# EAGLE schematic M225A (EAGLE 6.6.0)
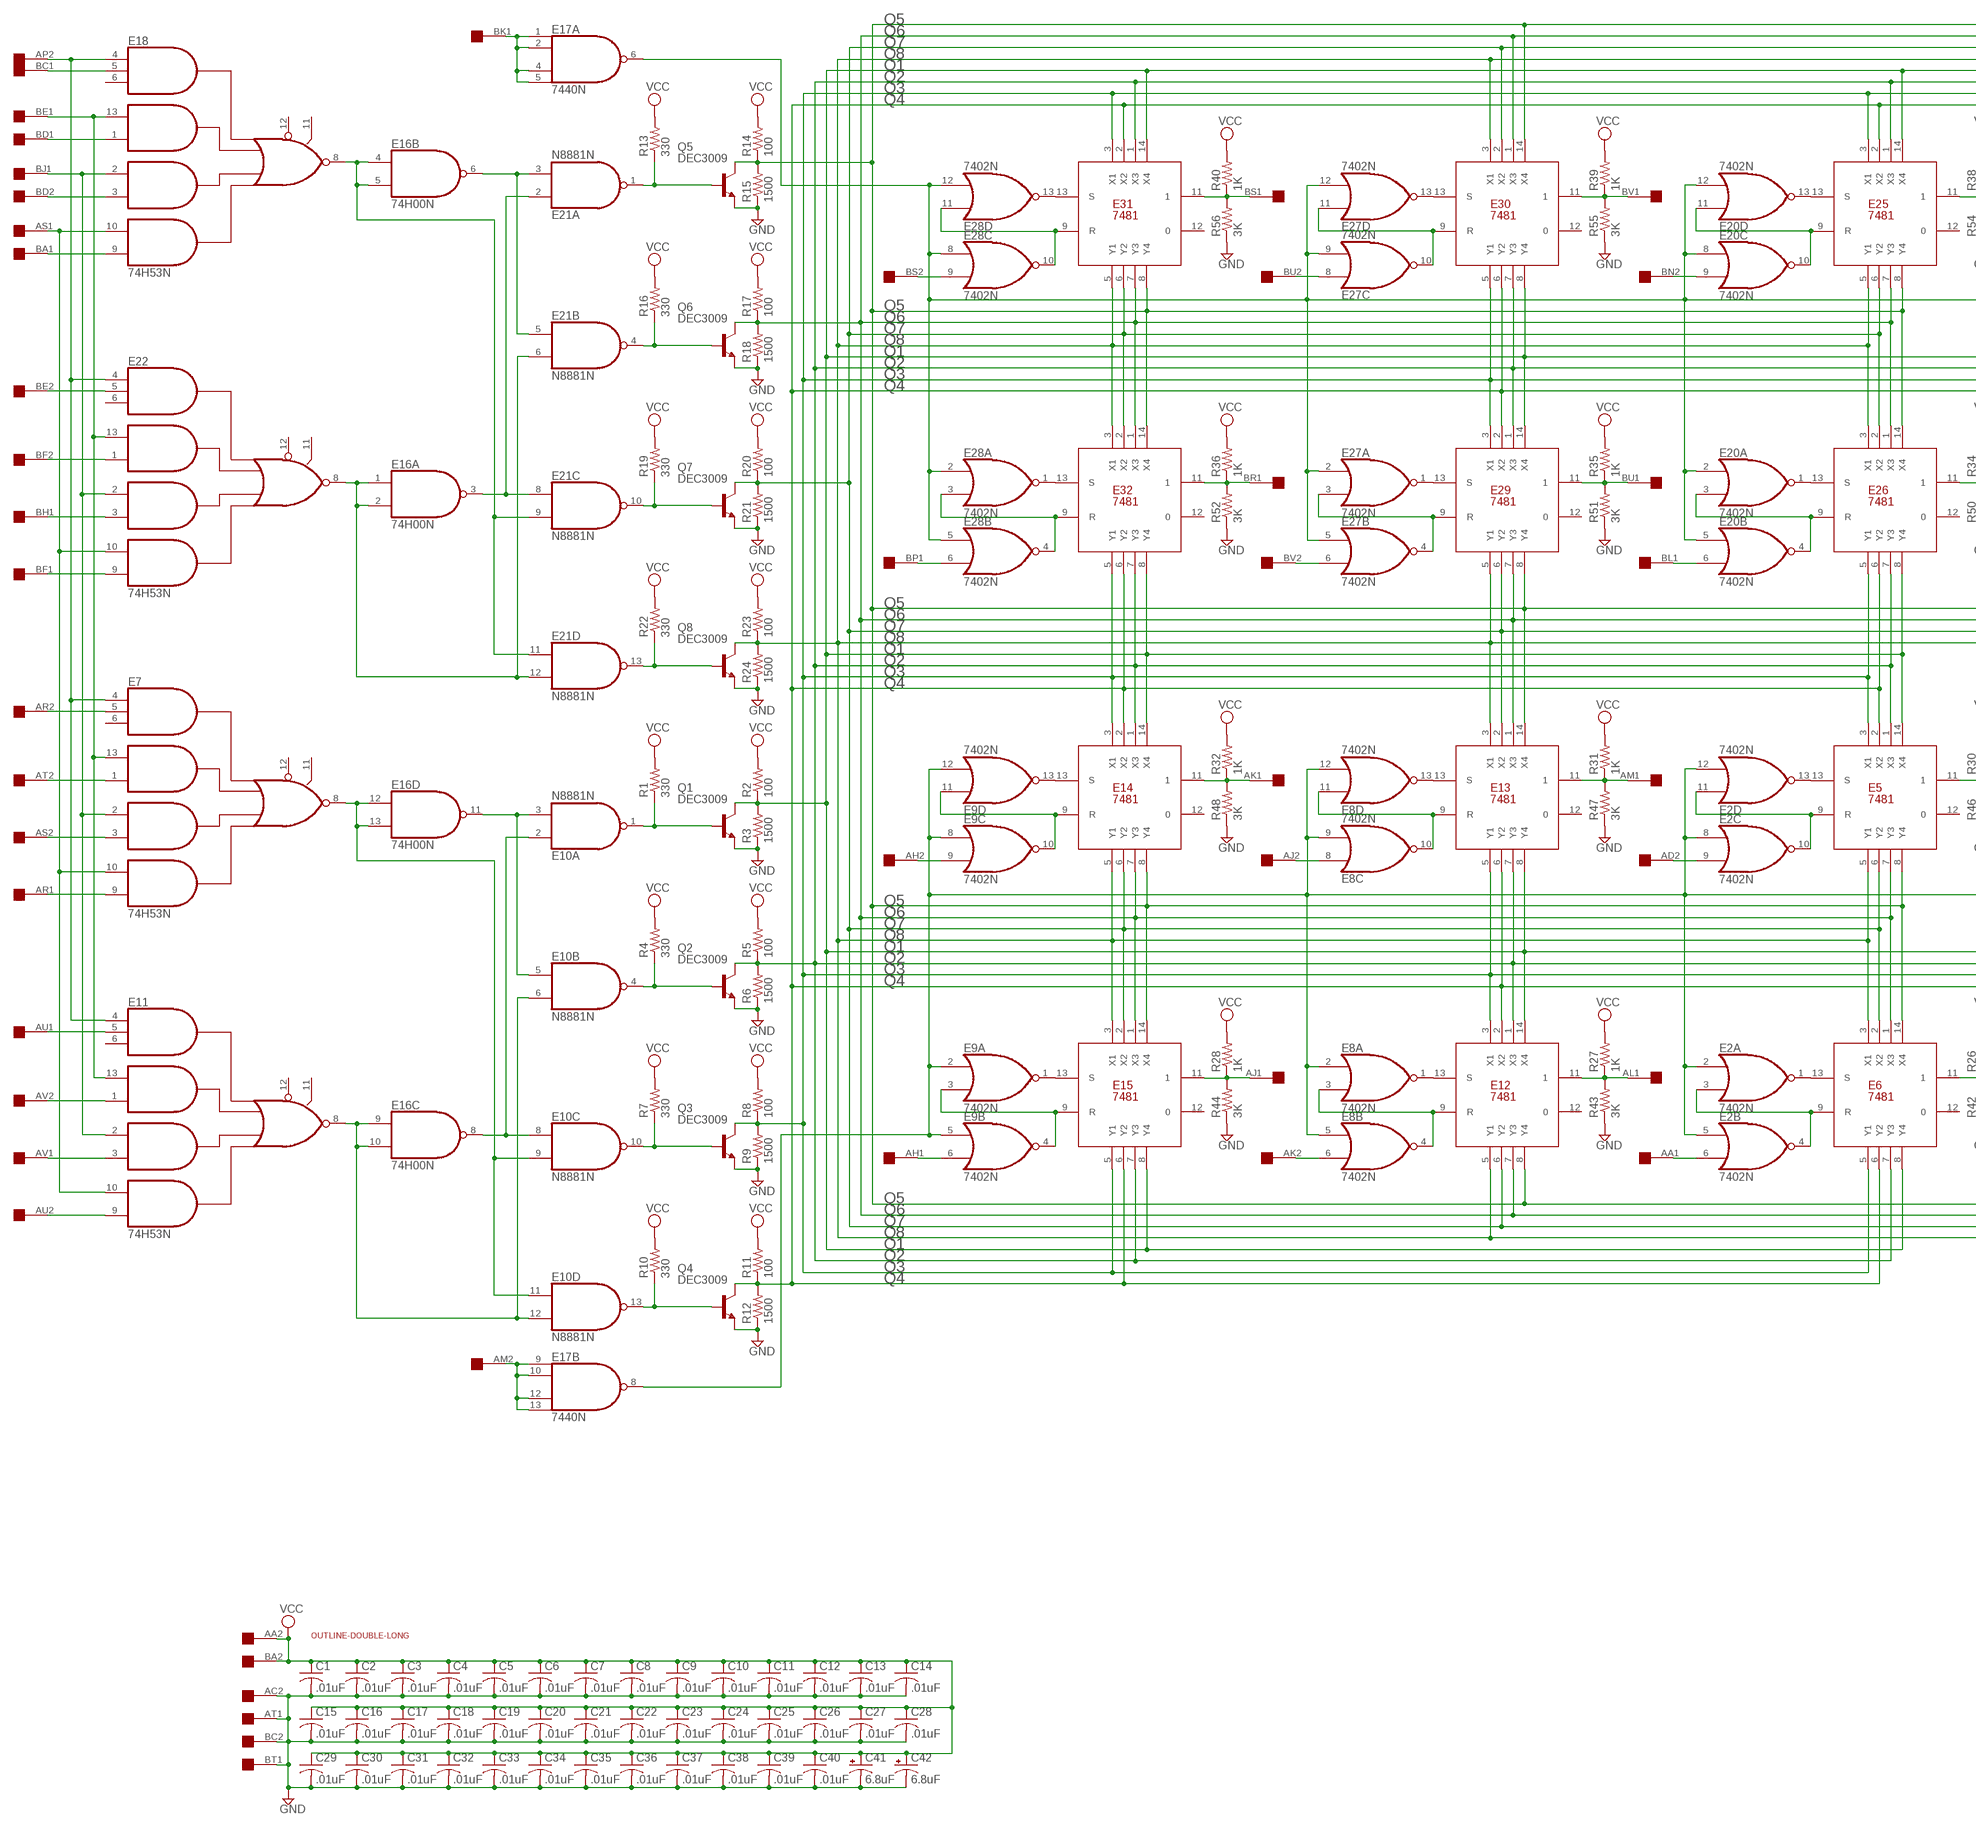
[diagram p0: schematic, sheet 1, part 1 of 2]
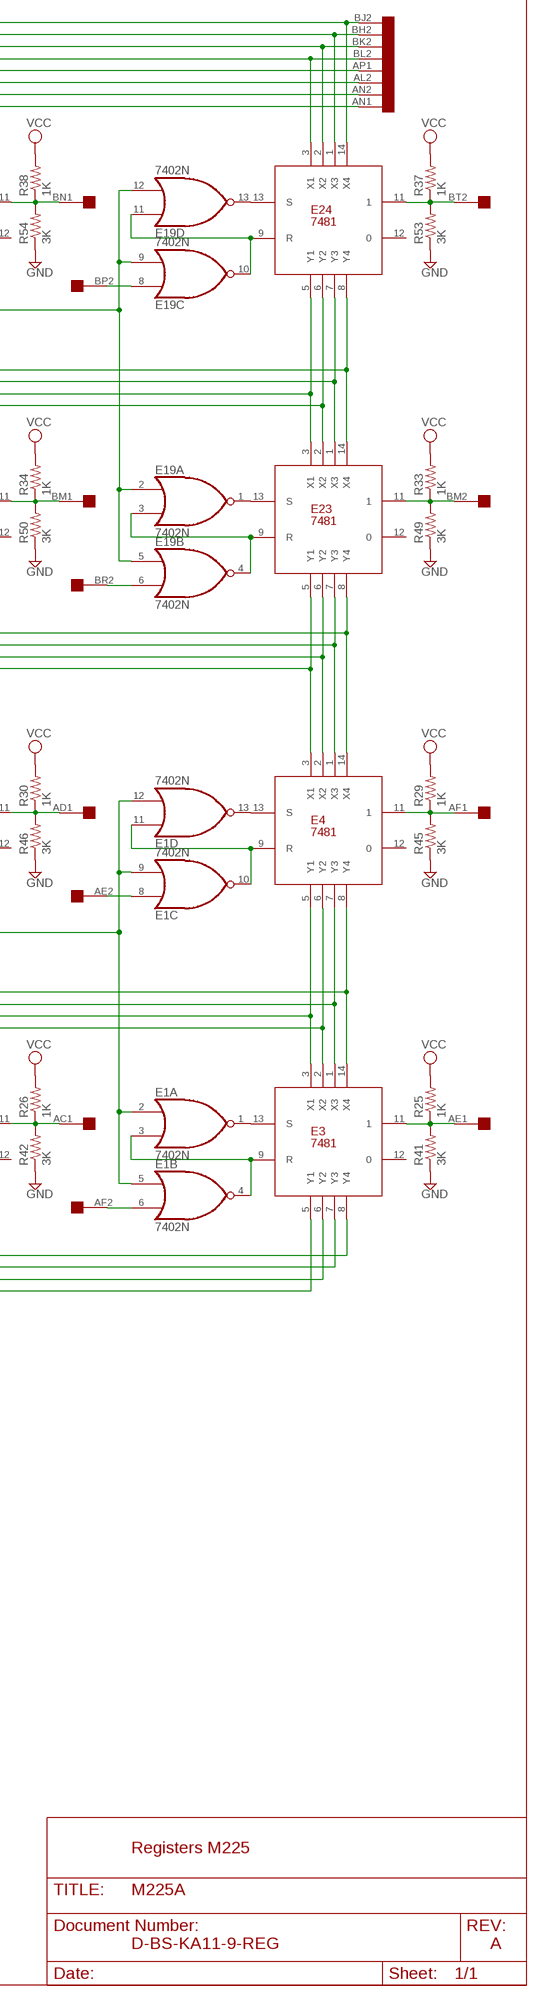
[diagram p1: schematic, sheet 1, part 2 of 2]

## Parts
C1  .01uF  C-US050-025X075  [C050-025X075]
C2  .01uF  C-US050-025X075  [C050-025X075]
C3  .01uF  C-US050-025X075  [C050-025X075]
C4  .01uF  C-US050-025X075  [C050-025X075]
C5  .01uF  C-US050-025X075  [C050-025X075]
C6  .01uF  C-US050-025X075  [C050-025X075]
C7  .01uF  C-US050-025X075  [C050-025X075]
C8  .01uF  C-US050-025X075  [C050-025X075]
C9  .01uF  C-US050-025X075  [C050-025X075]
C10  .01uF  C-US050-025X075  [C050-025X075]
C11  .01uF  C-US050-025X075  [C050-025X075]
C12  .01uF  C-US050-025X075  [C050-025X075]
C13  .01uF  C-US050-025X075  [C050-025X075]
C14  .01uF  C-US050-025X075  [C050-025X075]
C15  .01uF  C-US050-025X075  [C050-025X075]
C16  .01uF  C-US050-025X075  [C050-025X075]
C17  .01uF  C-US050-025X075  [C050-025X075]
C18  .01uF  C-US050-025X075  [C050-025X075]
C19  .01uF  C-US050-025X075  [C050-025X075]
C20  .01uF  C-US050-025X075  [C050-025X075]
C21  .01uF  C-US050-025X075  [C050-025X075]
C22  .01uF  C-US050-025X075  [C050-025X075]
C23  .01uF  C-US050-025X075  [C050-025X075]
C24  .01uF  C-US050-025X075  [C050-025X075]
C25  .01uF  C-US050-025X075  [C050-025X075]
C26  .01uF  C-US050-025X075  [C050-025X075]
C27  .01uF  C-US050-025X075  [C050-025X075]
C28  .01uF  C-US050-025X075  [C050-025X075]
C29  .01uF  C-US050-025X075  [C050-025X075]
C30  .01uF  C-US050-025X075  [C050-025X075]
C31  .01uF  C-US050-025X075  [C050-025X075]
C32  .01uF  C-US050-025X075  [C050-025X075]
C33  .01uF  C-US050-025X075  [C050-025X075]
C34  .01uF  C-US050-025X075  [C050-025X075]
C35  .01uF  C-US050-025X075  [C050-025X075]
C36  .01uF  C-US050-025X075  [C050-025X075]
C37  .01uF  C-US050-025X075  [C050-025X075]
C38  .01uF  C-US050-025X075  [C050-025X075]
C39  .01uF  C-US050-025X075  [C050-025X075]
C40  .01uF  C-US050-025X075  [C050-025X075]
C41  6.8uF  CPOL-USE20-8AXIAL  [E12-8]
C42  6.8uF  CPOL-USE20-8AXIAL  [E12-8]
E1  7402N  [DIL14]
E2  7402N  [DIL14]
E3  7481  [DIL14]
E4  7481  [DIL14]
E5  7481  [DIL14]
E6  7481  [DIL14]
E7  74H53N  [DIL14]
E8  7402N  [DIL14]
E9  7402N  [DIL14]
E10  N8881N  [DIL14]
E11  74H53N  [DIL14]
E12  7481  [DIL14]
E13  7481  [DIL14]
E14  7481  [DIL14]
E15  7481  [DIL14]
E16  74H00N  74S00N  [DIL14]
E17  7440N  [DIL14]
E18  74H53N  [DIL14]
E19  7402N  [DIL14]
E20  7402N  [DIL14]
E21  N8881N  [DIL14]
E22  74H53N  [DIL14]
E23  7481  [DIL14]
E24  7481  [DIL14]
E25  7481  [DIL14]
E26  7481  [DIL14]
E27  7402N  [DIL14]
E28  7402N  [DIL14]
E29  7481  [DIL14]
E30  7481  [DIL14]
E31  7481  [DIL14]
E32  7481  [DIL14]
Q1  DEC3009  -NPN-TO5  [TO5]
Q2  DEC3009  -NPN-TO5  [TO5]
Q3  DEC3009  -NPN-TO5  [TO5]
Q4  DEC3009  -NPN-TO5  [TO5]
Q5  DEC3009  -NPN-TO5  [TO5]
Q6  DEC3009  -NPN-TO5  [TO5]
Q7  DEC3009  -NPN-TO5  [TO5]
Q8  DEC3009  -NPN-TO5  [TO5]
R1  330  R-US_0207/10  [0207/10]
R2  100  R-US_0207/10  [0207/10]
R3  1500  R-US_0207/10  [0207/10]
R4  330  R-US_0207/10  [0207/10]
R5  100  R-US_0207/10  [0207/10]
R6  1500  R-US_0207/10  [0207/10]
R7  330  R-US_0207/10  [0207/10]
R8  100  R-US_0207/10  [0207/10]
R9  1500  R-US_0207/10  [0207/10]
R10  330  R-US_0207/10  [0207/10]
R11  100  R-US_0207/10  [0207/10]
R12  1500  R-US_0207/10  [0207/10]
R13  330  R-US_0207/10  [0207/10]
R14  100  R-US_0207/10  [0207/10]
R15  1500  R-US_0207/10  [0207/10]
R16  330  R-US_0207/10  [0207/10]
R17  100  R-US_0207/10  [0207/10]
R18  1500  R-US_0207/10  [0207/10]
R19  330  R-US_0207/10  [0207/10]
R20  100  R-US_0207/10  [0207/10]
R21  1500  R-US_0207/10  [0207/10]
R22  330  R-US_0207/10  [0207/10]
R23  100  R-US_0207/10  [0207/10]
R24  1500  R-US_0207/10  [0207/10]
R25  1K  R-US_0207/10  [0207/10]
R26  1K  R-US_0207/10  [0207/10]
R27  1K  R-US_0207/10  [0207/10]
R28  1K  R-US_0207/10  [0207/10]
R29  1K  R-US_0207/10  [0207/10]
R30  1K  R-US_0207/10  [0207/10]
R31  1K  R-US_0207/10  [0207/10]
R32  1K  R-US_0207/10  [0207/10]
R33  1K  R-US_0207/10  [0207/10]
R34  1K  R-US_0207/10  [0207/10]
R35  1K  R-US_0207/10  [0207/10]
R36  1K  R-US_0207/10  [0207/10]
R37  1K  R-US_0207/10  [0207/10]
R38  1K  R-US_0207/10  [0207/10]
R39  1K  R-US_0207/10  [0207/10]
R40  1K  R-US_0207/10  [0207/10]
R41  3K  R-US_0207/10  [0207/10]
R42  3K  R-US_0207/10  [0207/10]
R43  3K  R-US_0207/10  [0207/10]
R44  3K  R-US_0207/10  [0207/10]
R45  3K  R-US_0207/10  [0207/10]
R46  3K  R-US_0207/10  [0207/10]
R47  3K  R-US_0207/10  [0207/10]
R48  3K  R-US_0207/10  [0207/10]
R49  3K  R-US_0207/10  [0207/10]
R50  3K  R-US_0207/10  [0207/10]
R51  3K  R-US_0207/10  [0207/10]
R52  3K  R-US_0207/10  [0207/10]
R53  3K  R-US_0207/10  [0207/10]
R54  3K  R-US_0207/10  [0207/10]
R55  3K  R-US_0207/10  [0207/10]
R56  3K  R-US_0207/10  [0207/10]
U$1  OUTLINE-DOUBLE-LONG  [DOUBLE-LONG]
U$3  DOUBLE  [EDGE-CON4]

## Nets
GND [supply]: C1.2 C2.2 C3.2 C4.2 C5.2 C6.2 C7.2 C8.2 C9.2 C10.2 C11.2 C12.2 C13.2 C14.2 C15.2 C16.2 C17.2 C18.2 C19.2 C20.2 C21.2 C22.2 C23.2 C24.2 C25.2 C26.2 C27.2 C28.2 C29.2 C30.2 C31.2 C32.2 C33.2 C34.2 C35.2 C36.2 C37.2 C38.2 C39.2 C40.2 C41.- C42.- Q1.1(E) Q2.1(E) Q3.1(E) Q4.1(E) Q5.1(E) Q6.1(E) Q7.1(E) Q8.1(E) R3.1 R6.1 R9.1 R12.1 R15.1 R18.1 R21.1 R24.1 R41.1 R42.1 R43.1 R44.1 R45.1 R46.1 R47.1 R48.1 R49.1 R50.1 R51.1 R52.1 R53.1 R54.1 R55.1 R56.1 U$3.AC2 U$3.AT1 U$3.BC2 U$3.BT1
N$1: E1.3(A:I1) E1.4(B:O) E3.9(R)
N$2: E9.6(B:I1) U$3.AH1
N$3: E1.6(B:I1) U$3.AF2
N$4: E1.1(A:O) E3.13(S)
N$5: E1.13(D:O) E4.13(S)
N$6: E1.10(C:O) E1.11(D:I0) E4.9(R)
N$7: E8.6(B:I1) U$3.AK2
N$8: E1.8(C:I0) U$3.AE2
N$11: E17.1(A:I0) E17.2(A:I1) E17.4(A:I2) E17.5(A:I3) U$3.BK1
N$13: E4.11 R29.1 R45.2 U$3.AF1
N$14: E3.11 R25.1 R41.2 U$3.AE1
N$15: E5.11 R30.1 R46.2 U$3.AD1
N$16: E10.1(A:O) Q1.2(B) R1.1
N$18: E6.11 R26.1 R42.2 U$3.AC1
N$19: E10.4(B:O) Q2.2(B) R4.1
N$20: E7.4(I1) E11.4(I1) E18.4(I1) E22.4(I1) U$3.AP2
N$21: E10.10(C:O) Q3.2(B) R7.1
N$23: E10.13(D:O) Q4.2(B) R10.1
N$25: E21.1(A:O) Q5.2(B) R13.1
N$26: E1.2(A:I0) E1.5(B:I0) E1.9(C:I1) E1.12(D:I1) E2.2(A:I0) E2.5(B:I0) E2.8(C:I0) E2.12(D:I1) E8.2(A:I0) E8.5(B:I0) E8.9(C:I1) E8.12(D:I1) E9.2(A:I0) E9.5(B:I0) E9.8(C:I0) E9.12(D:I1) E17.8(B:O)
N$27: E21.4(B:O) Q6.2(B) R16.1
N$28: E8.8(C:I0) U$3.AJ2
N$29: E21.10(C:O) Q7.2(B) R19.1
N$30: E17.6(A:O) E19.2(A:I0) E19.5(B:I0) E19.9(C:I1) E19.12(D:I1) E20.2(A:I0) E20.5(B:I0) E20.8(C:I0) E20.12(D:I1) E27.2(A:I0) E27.5(B:I0) E27.9(C:I1) E27.12(D:I1) E28.2(A:I0) E28.5(B:I0) E28.8(C:I0) E28.12(D:I1)
N$31: E21.13(D:O) Q8.2(B) R22.1
N$32: E19.6(B:I1) U$3.BR2
N$33: E12.11 R27.1 R43.2 U$3.AL1
N$34: E15.11 R28.1 R44.2 U$3.AJ1
N$35: E13.11 R31.1 R47.2 U$3.AM1
N$36: E14.11 R32.1 R48.2 U$3.AK1
N$37: E23.11 R33.1 R49.2 U$3.BM2
N$38: E26.11 R34.1 R50.2 U$3.BM1
N$39: E29.11 R35.1 R51.2 U$3.BU1
N$40: E32.11 R36.1 R52.2 U$3.BR1
N$41: E24.11 R37.1 R53.2 U$3.BT2
N$42: E25.11 R38.1 R54.2 U$3.BN1
N$43: E30.11 R39.1 R55.2 U$3.BV1
N$44: E31.11 R40.1 R56.2 U$3.BS1
N$45: E7.13(I3) E11.13(I3) E18.13(I3) E22.13(I3) U$3.BE1
N$46: E18.1(I4) U$3.BD1
N$47: E7.2(I5) E11.2(I5) E18.2(I5) E22.2(I5) U$3.BJ1
N$48: E18.3(I6) U$3.BD2
N$50: E18.5(I11) U$3.BC1
N$51: E18.9(I8) U$3.BA1
N$52: E7.10(I7) E11.10(I7) E18.10(I7) E22.10(I7) U$3.AS1
N$53: E7.1(I4) U$3.AT2
N$54: E22.5(I11) U$3.BE2
N$55: E22.1(I4) U$3.BF2
N$56: E22.3(I6) U$3.BH1
N$57: E22.9(I8) U$3.BF1
N$58: E11.9(I8) U$3.AU2
N$59: E11.3(I6) U$3.AV1
N$60: E11.1(I4) U$3.AV2
N$61: E11.5(I11) U$3.AU1
N$62: E7.9(I8) U$3.AR1
N$63: E7.3(I6) U$3.AS2
N$64: E7.5(I11) U$3.AR2
N$65: E10.6(B:I1) E10.12(D:I1) E11.8(O) E16.9(C:I0) E16.10(C:I1)
N$66: E7.8(O) E10.9(C:I1) E10.11(D:I0) E16.12(D:I0) E16.13(D:I1)
N$67: E16.1(A:I0) E16.2(A:I1) E21.6(B:I1) E21.12(D:I1) E22.8(O)
N$68: E16.4(B:I0) E16.5(B:I1) E18.8(O) E21.9(C:I1) E21.11(D:I0)
N$69: E17.9(B:I0) E17.10(B:I1) E17.12(B:I2) E17.13(B:I3) U$3.AM2
N$70: E10.2(A:I0) E10.8(C:I0) E16.8(C:O)
N$71: E10.3(A:I1) E10.5(B:I0) E16.11(D:O)
N$72: E16.3(A:O) E21.2(A:I0) E21.8(C:I0)
N$73: E2.6(B:I1) U$3.AA1
N$74: E16.6(B:O) E21.3(A:I1) E21.5(B:I0)
N$76: E20.6(B:I1) U$3.BL1
N$77: E9.3(A:I1) E9.4(B:O) E15.9(R)
N$78: E9.1(A:O) E15.13(S)
N$79: E9.13(D:O) E14.13(S)
N$80: E9.10(C:O) E9.11(D:I0) E14.9(R)
N$81: E28.6(B:I1) U$3.BP1
N$82: E8.1(A:O) E12.13(S)
N$83: E8.13(D:O) E13.13(S)
N$84: E8.10(C:O) E8.11(D:I0) E13.9(R)
N$85: E2.9(C:I1) U$3.AD2
N$86: E27.6(B:I1) U$3.BV2
N$87: E8.3(A:I1) E8.4(B:O) E12.9(R)
N$88: E2.1(A:O) E6.13(S)
N$89: E2.13(D:O) E5.13(S)
N$90: E2.10(C:O) E2.11(D:I0) E5.9(R)
N$91: E9.9(C:I1) U$3.AH2
N$92: E28.9(C:I1) U$3.BS2
N$93: E2.3(A:I1) E2.4(B:O) E6.9(R)
N$94: E28.1(A:O) E32.13(S)
N$95: E28.13(D:O) E31.13(S)
N$96: E28.10(C:O) E28.11(D:I0) E31.9(R)
N$97: E28.3(A:I1) E28.4(B:O) E32.9(R)
N$98: E27.8(C:I0) U$3.BU2
N$99: E19.1(A:O) E23.13(S)
N$100: E19.13(D:O) E24.13(S)
N$101: E19.3(A:I1) E19.4(B:O) E23.9(R)
N$102: E19.10(C:O) E19.11(D:I0) E24.9(R)
N$103: E20.9(C:I1) U$3.BN2
N$104: E19.8(C:I0) U$3.BP2
N$107: E20.1(A:O) E26.13(S)
N$108: E20.13(D:O) E25.13(S)
N$109: E27.1(A:O) E29.13(S)
N$110: E27.13(D:O) E30.13(S)
N$111: E27.10(C:O) E27.11(D:I0) E30.9(R)
N$113: E27.3(A:I1) E27.4(B:O) E29.9(R)
N$115: E20.3(A:I1) E20.4(B:O) E26.9(R)
N$116: E20.10(C:O) E20.11(D:I0) E25.9(R)
Q1: E3.14(X4) E4.8(Y4) E5.14(X4) E6.8(Y4) E12.14(X4) E13.8(Y4) E14.14(X4) E15.8(Y4) E23.14(X4) E24.8(Y4) E25.14(X4) E26.8(Y4) E29.14(X4) E30.8(Y4) E31.14(X4) E32.8(Y4) Q1.3(C) R2.1 R3.2 U$3.AP1
Q2: E3.1(X3) E4.7(Y3) E5.1(X3) E6.7(Y3) E12.1(X3) E13.7(Y3) E14.1(X3) E15.7(Y3) E23.1(X3) E24.7(Y3) E25.1(X3) E26.7(Y3) E29.1(X3) E30.7(Y3) E31.1(X3) E32.7(Y3) Q2.3(C) R5.1 R6.2 U$3.AL2
Q3: E3.3(X1) E4.5(Y1) E5.3(X1) E6.5(Y1) E12.3(X1) E13.5(Y1) E14.3(X1) E15.5(Y1) E23.3(X1) E24.5(Y1) E25.3(X1) E26.5(Y1) E29.3(X1) E30.5(Y1) E31.3(X1) E32.5(Y1) Q3.3(C) R8.1 R9.2 U$3.AN2
Q4: E3.2(X2) E4.6(Y2) E5.2(X2) E6.6(Y2) E12.2(X2) E13.6(Y2) E14.2(X2) E15.6(Y2) E23.2(X2) E24.6(Y2) E25.2(X2) E26.6(Y2) E29.2(X2) E30.6(Y2) E31.2(X2) E32.6(Y2) Q4.3(C) R11.1 R12.2 U$3.AN1
Q5: E3.8(Y4) E4.14(X4) E5.8(Y4) E6.14(X4) E12.8(Y4) E13.14(X4) E14.8(Y4) E15.14(X4) E23.8(Y4) E24.14(X4) E25.8(Y4) E26.14(X4) E29.8(Y4) E30.14(X4) E31.8(Y4) E32.14(X4) Q5.3(C) R14.1 R15.2 U$3.BJ2
Q6: E3.7(Y3) E4.1(X3) E5.7(Y3) E6.1(X3) E12.7(Y3) E13.1(X3) E14.7(Y3) E15.1(X3) E23.7(Y3) E24.1(X3) E25.7(Y3) E26.1(X3) E29.7(Y3) E30.1(X3) E31.7(Y3) E32.1(X3) Q6.3(C) R17.1 R18.2 U$3.BH2
Q7: E3.6(Y2) E4.2(X2) E5.6(Y2) E6.2(X2) E12.6(Y2) E13.2(X2) E14.6(Y2) E15.2(X2) E23.6(Y2) E24.2(X2) E25.6(Y2) E26.2(X2) E29.6(Y2) E30.2(X2) E31.6(Y2) E32.2(X2) Q7.3(C) R20.1 R21.2 U$3.BK2
Q8: E3.5(Y1) E4.3(X1) E5.5(Y1) E6.3(X1) E12.5(Y1) E13.3(X1) E14.5(Y1) E15.3(X1) E23.5(Y1) E24.3(X1) E25.5(Y1) E26.3(X1) E29.5(Y1) E30.3(X1) E31.5(Y1) E32.3(X1) Q8.3(C) R23.1 R24.2 U$3.BL2
VCC [supply]: C1.1 C2.1 C3.1 C4.1 C5.1 C6.1 C7.1 C8.1 C9.1 C10.1 C11.1 C12.1 C13.1 C14.1 C15.1 C16.1 C17.1 C18.1 C19.1 C20.1 C21.1 C22.1 C23.1 C24.1 C25.1 C26.1 C27.1 C28.1 C29.1 C30.1 C31.1 C32.1 C33.1 C34.1 C35.1 C36.1 C37.1 C38.1 C39.1 C40.1 C41.+ C42.+ R1.2 R2.2 R4.2 R5.2 R7.2 R8.2 R10.2 R11.2 R13.2 R14.2 R16.2 R17.2 R19.2 R20.2 R22.2 R23.2 R25.2 R26.2 R27.2 R28.2 R29.2 R30.2 R31.2 R32.2 R33.2 R34.2 R35.2 R36.2 R37.2 R38.2 R39.2 R40.2 U$3.AA2 U$3.BA2
Unconnected: E3.12 E4.12 E5.12 E6.12 E7.6(I2) E7.11(I10) E7.12(I9) E11.6(I2) E11.11(I10) E11.12(I9) E12.12 E13.12 E14.12 E15.12 E17.3(3:NC) E17.11(11:NC) E18.6(I2) E18.11(I10) E18.12(I9) E22.6(I2) E22.11(I10) E22.12(I9) E23.12 E24.12 E25.12 E26.12 E29.12 E30.12 E31.12 E32.12 U$3.AB1 U$3.AB2 U$3.BB1 U$3.BB2

## Notes on the sheet
- Registers M225
- D-BS-KA11-9-REG | A

## Power pins joined to a net without a drawn wire
GND: E1.7(P:GND) E2.7(P:GND) E3.10(GND) E4.10(GND) E5.10(GND) E6.10(GND) E7.7(GND) E8.7(P:GND) E9.7(P:GND) E10.7(P:GND) E11.7(GND) E12.10(GND) E13.10(GND) E14.10(GND) E15.10(GND) E16.7(P:GND) E17.7(P:GND) E18.7(GND) E19.7(P:GND) E20.7(P:GND) E21.7(P:GND) E22.7(GND) E23.10(GND) E24.10(GND) E25.10(GND) E26.10(GND) E27.7(P:GND) E28.7(P:GND) E29.10(GND) E30.10(GND) E31.10(GND) E32.10(GND)
VCC: E1.14(P:VCC) E2.14(P:VCC) E3.4(VCC) E4.4(VCC) E5.4(VCC) E6.4(VCC) E7.14(VCC) E8.14(P:VCC) E9.14(P:VCC) E10.14(P:VCC) E11.14(VCC) E12.4(VCC) E13.4(VCC) E14.4(VCC) E15.4(VCC) E16.14(P:VCC) E17.14(P:VCC) E18.14(VCC) E19.14(P:VCC) E20.14(P:VCC) E21.14(P:VCC) E22.14(VCC) E23.4(VCC) E24.4(VCC) E25.4(VCC) E26.4(VCC) E27.14(P:VCC) E28.14(P:VCC) E29.4(VCC) E30.4(VCC) E31.4(VCC) E32.4(VCC)

## Library data of the parts
C1-C40 = rcl:C-US: CAPACITOR, American symbol
C41 C42 = dec-con:CPOL-USE20-8AXIAL: A 0.8 inch electrolytic.
E1 E2 E8 E9 E19 E20 E27 E28 = 74xx-us:74*02: Quad 2-input NOR gate
E3-E6 E12-E15 E23-E26 E29-E32 = dec-con:74*81: 16 Memory, X & Y Row/Column Selects
E7 E11 E18 E22 = dec-con:74H53N: 2-2-2-3 Input And-Or-Invert Gate
E10 E21 = dec-con:N8881: Quad 2-input NAND gate, open collector
E16 = 74xx-us:74*00: Quad 2-input NAND gate
E17 = dec-con:74*40: Dual 4-input NAND gate
Q1-Q8 = transistor:*-NPN-: NPN Transistror BF959 corrected 2008.03.06
R1-R56 = rcl:R-US_: RESISTOR, American symbol
U$1 = dec-con:OUTLINE-*: Board outlines for DEC boards.
U$3 = dec-con:DOUBLE: Double-Height DEC board

## Net classes
1 supply: width 0.813 mm